# Altium schematic sheet main.SchDoc
size A
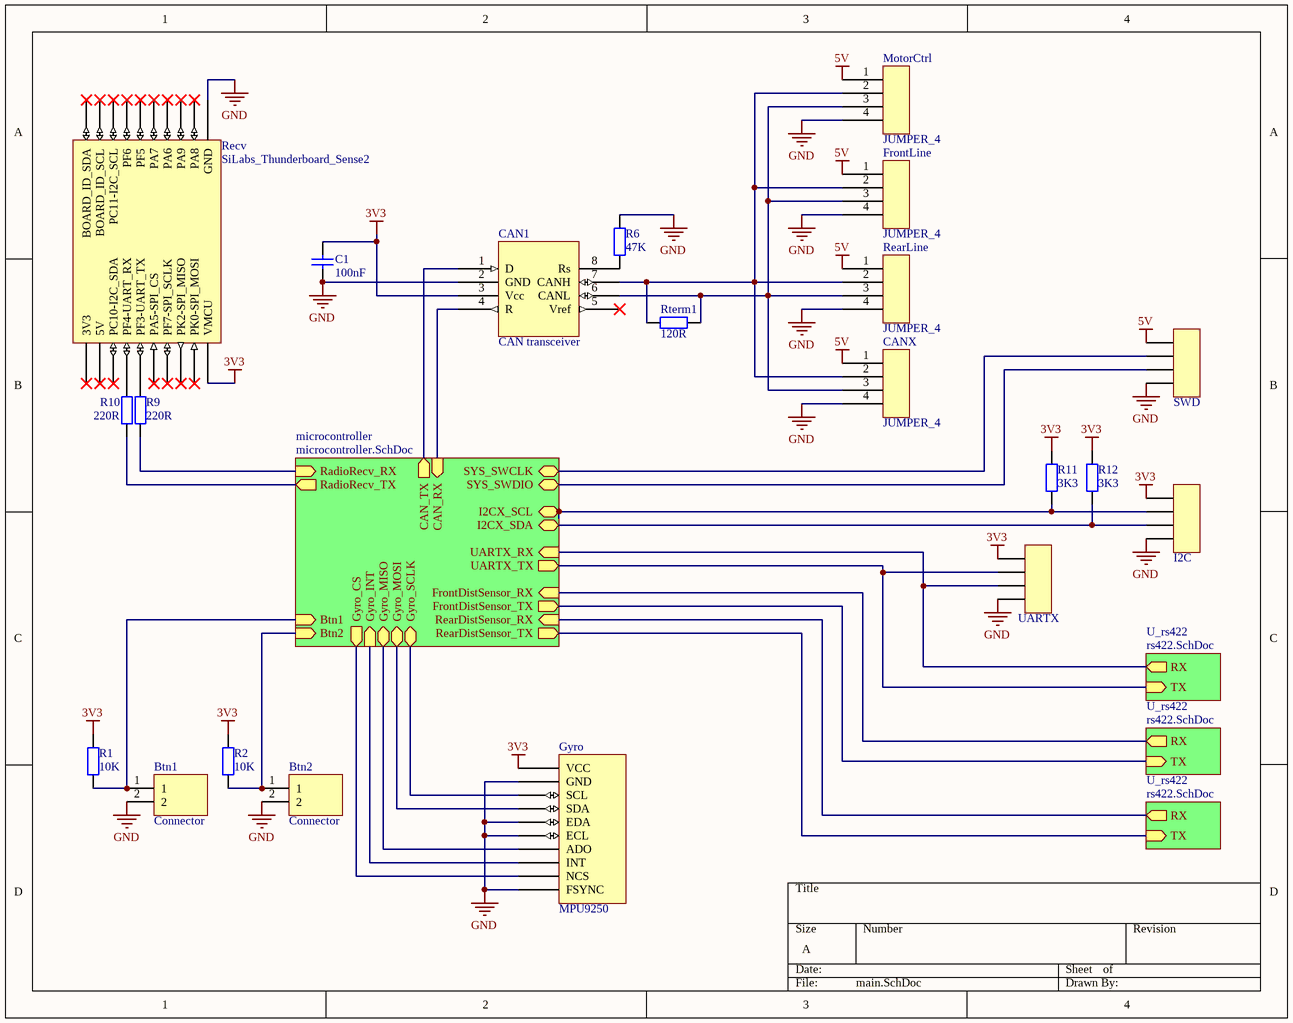
[diagram p0: main.SchDoc]

## Parts
Btn1  Connector  [FP_CONN2_TUSKE_254MM]
Btn2  Connector  [FP_CONN2_TUSKE_254MM]
C1  100nF  [FP_0805_CAP_085]
CAN1  CAN transceiver  [SOIC-8]
CANX  JUMPER_4  [JUMPER_4]
FrontLine  JUMPER_4  [JUMPER_4]
Gyro  MPU9250  [MPU9250]
I2C  4-Pin Header  [4-Pin Header]  (value not drawn)
MotorCtrl  JUMPER_4  [JUMPER_4]
R1  10K  [FP_0805_RES]
R2  10K  [FP_0805_RES]
R6  47K  [FP_0805_RES]
R9  220R  [FP_0805_RES]
R10  220R  [FP_0805_RES]
R11  3K3  [FP_0805_RES]
R12  3K3  [FP_0805_RES]
RearLine  JUMPER_4  [JUMPER_4]
Recv  SiLabs_Thunderboard_Sense2  [SiLabs_Thunderbird_Sense2]
Rterm1  120R  [FP_0805_RES]
SWD  4-Pin Header  [4-Pin Header]  (value not drawn)
UARTX  4-Pin Header  [4-Pin Header]  (value not drawn)

## Sub-sheets
microcontroller = microcontroller.SchDoc: Btn1 (in), Btn2 (in), RadioRecv_RX (in), RadioRecv_TX (out), Gyro_SCLK (bidir), Gyro_MISO (bidir), Gyro_MOSI (bidir), Gyro_CS (out), Gyro_INT (in), UARTX_TX (out), I2CX_SDA (bidir), CAN_RX (in), CAN_TX (out), SYS_SWCLK (bidir), I2CX_SCL (bidir), UARTX_RX (in), SYS_SWDIO (bidir), FrontDistSensor_TX (out), RearDistSensor_RX (in), RearDistSensor_TX (out), FrontDistSensor_RX (in)
U_rs422 = rs422.SchDoc: RX (out), TX (in)
U_rs422 = rs422.SchDoc: RX (out), TX (in)
U_rs422 = rs422.SchDoc: RX (out), TX (in)

## Nets
3V3: C1.1 CAN1.3(Vcc) Gyro.VCC I2C.1 R1.2 R2.2 R11.2 R12.2 Recv.2(VMCU) UARTX.1
5V: CANX.1 FrontLine.1 MotorCtrl.1 RearLine.1 SWD.1
GND: Btn1.2 Btn2.2 C1.2 CAN1.2(GND) CANX.4 FrontLine.4 Gyro.ECL Gyro.EDA Gyro.FSYNC Gyro.GND I2C.4 MotorCtrl.4 R6.2 RearLine.4 Recv.1(GND) SWD.4 UARTX.4
NetBtn1_1: Btn1.1 R1.1 ; sheet microcontroller/Btn1
NetBtn2_1: Btn2.1 R2.1 ; sheet microcontroller/Btn2
NetCAN1_1: CAN1.1(D) ; sheet microcontroller/CAN_TX
NetCAN1_4: CAN1.4(R) ; sheet microcontroller/CAN_RX
NetCAN1_6: CAN1.6(CANL) CANX.3 FrontLine.3 MotorCtrl.3 RearLine.3 Rterm1.2
NetCAN1_7: CAN1.7(CANH) CANX.2 FrontLine.2 MotorCtrl.2 RearLine.2 Rterm1.1
NetCAN1_8: CAN1.8(Rs) R6.1
NetGyro_ADO: Gyro.ADO ; sheet microcontroller/Gyro_MISO
NetGyro_INT: Gyro.INT ; sheet microcontroller/Gyro_INT
NetGyro_NCS: Gyro.NCS ; sheet microcontroller/Gyro_CS
NetGyro_SCL: Gyro.SCL ; sheet microcontroller/Gyro_SCLK
NetGyro_SDA: Gyro.SDA ; sheet microcontroller/Gyro_MOSI
NetI2C_2: I2C.2 R11.1 ; sheet microcontroller/I2CX_SCL
NetI2C_3: I2C.3 R12.1 ; sheet microcontroller/I2CX_SDA
NetR9_1: R9.1 ; sheet microcontroller/RadioRecv_RX
NetR9_2: R9.2 Recv.12(PF3-UART_TX)
NetR10_1: R10.1 ; sheet microcontroller/RadioRecv_TX
NetR10_2: R10.2 Recv.14(PF4-UART_RX)
NetSWD_2: SWD.2 ; sheet microcontroller/SYS_SWCLK
NetSWD_3: SWD.3 ; sheet microcontroller/SYS_SWDIO
NetUARTX_2: UARTX.2 ; sheet U_rs422/TX, sheet microcontroller/UARTX_TX
NetUARTX_3: UARTX.3 ; sheet U_rs422/RX, sheet microcontroller/UARTX_RX
(unnamed): sheet U_rs422/RX, sheet microcontroller/FrontDistSensor_RX
(unnamed): sheet U_rs422/TX, sheet microcontroller/FrontDistSensor_TX
(unnamed): sheet U_rs422/RX, sheet microcontroller/RearDistSensor_RX
(unnamed): sheet U_rs422/TX, sheet microcontroller/RearDistSensor_TX

Not connected (* = marked no-connect by the designer): CAN1 5(Vref)*; Recv 3(PA8)* 4(PK0-SPI_MOSI)* 5(PA9)* 6(PK2-SPI_MISO)* 7(PA6)* 8(PF7-SPI_SCLK)* 9(PA7)* 10(PA5-SPI_CS)* 11(PF5)* 13(PF6)* 15(PC11-I2C_SCL)* 16(PC10-I2C_SDA)* 17(BOARD_ID_SCL)* 18(5V)* 19(BOARD_ID_SDA)* 20(3V3)*

## Library data of the parts
Btn1 Btn2 = Connector_2pin: 2pin connector
C1 = CAP 100nF: Capacitor; Tolerance: +80%/-20%; Voltage: 25V; Reference: 1759167; Name: SMD Multilayer Ceramic Capacitor, 0805; Supplier: Farnell; Value: 100nF
CAN1 = SN65HVD230
R1 R2 = RES 10K: Resistor; Tolerance: 5%; Power: 125mW; Name: YAGEO (PHYCOMP)  RC0805JR-0710KL  SMD Chip Resistor, Thick Film, 10 kohm; Reference: 9234136; Supplier: Farnell; Value: 10K
R6 = RES 47K: Resistor; Tolerance: 5%; Power: 125mW; Name: YAGEO (PHYCOMP)  RC0805JR-0747KL  SMD Chip Resistor, Thick Film, 47 kohm; Reference: 9234217; Supplier: Farnell; Value: 47K
R9 R10 = RES 220R: Resistor; Tolerance: 5%; Power: 125mW; Name: YAGEO (PHYCOMP)  RC0805JR-07220RL  SMD Chip Resistor, Thick Film, 220 ohm; Reference: 9233920; Supplier: Farnell; Value: 220R
R11 R12 = RES 3K3: Resistor; Tolerance: 1%; Power: 125mW; Name: YAGEO (PHYCOMP)  RC0805FR-073K3L  SMD Chip Resistor, Thick Film, 3.3 kohm, 150 V, 0805 [2012 Metric], 125 mW, ± 1%, RC Series; Reference: 9237682; Supplier: Farnell; Value: 3K3
Recv = SiLabs_Thunderboard_Sense2: Radio transmitter/receiver
Rterm1 = RES 120R: Resistor; Tolerance: 5%; Power: 125mW; Name: YAGEO (PHYCOMP)  RC0805JR-07120RL  SMD Chip Resistor, Thick Film, 120 ohm; Reference: 9233890; Supplier: Farnell; Value: 120R